# Altium project PCB_3U_DAC.PrjPCB (part 2 of 3)

## Sheet Output_channel.SchDoc: Output
size 420 x 297 mm; Author: G.K.; CompanyName: WUT; DrawnBy: G.K.; Organization: WUT ISE; Address1: Warsaw Univeristy of Technology; Address2: Nowowiejska 15/19; DocumentNumber: 4; Revision: -; SheetNumber: 4; SheetTotal: 7; EDA_Number: ARTIQ; Projet: Zotino; ModifiedBy: -; CreateDate: XX/XX/XXXX; CheckedDate: -; Title2: filter; DivGrp: ISE; Designer: G.K.; ModifiedDate: -; ProjectName: 32 CHANNEL 16bit DAC
Used 32 times, as channels U_Output_channel1, U_Output_channel2, U_Output_channel3, U_Output_channel4, U_Output_channel5, U_Output_channel6, U_Output_channel7, U_Output_channel8, U_Output_channel9, U_Output_channel10, U_Output_channel11, U_Output_channel12, U_Output_channel13, U_Output_channel14, U_Output_channel15, U_Output_channel16, U_Output_channel17, U_Output_channel18, U_Output_channel19, U_Output_channel20, U_Output_channel21, U_Output_channel22, U_Output_channel23, U_Output_channel24, U_Output_channel25, U_Output_channel26, U_Output_channel27, U_Output_channel28, U_Output_channel29, U_Output_channel30, U_Output_channel31, U_Output_channel32. Parts and nets are listed once, with the designators drawn on the sheet.
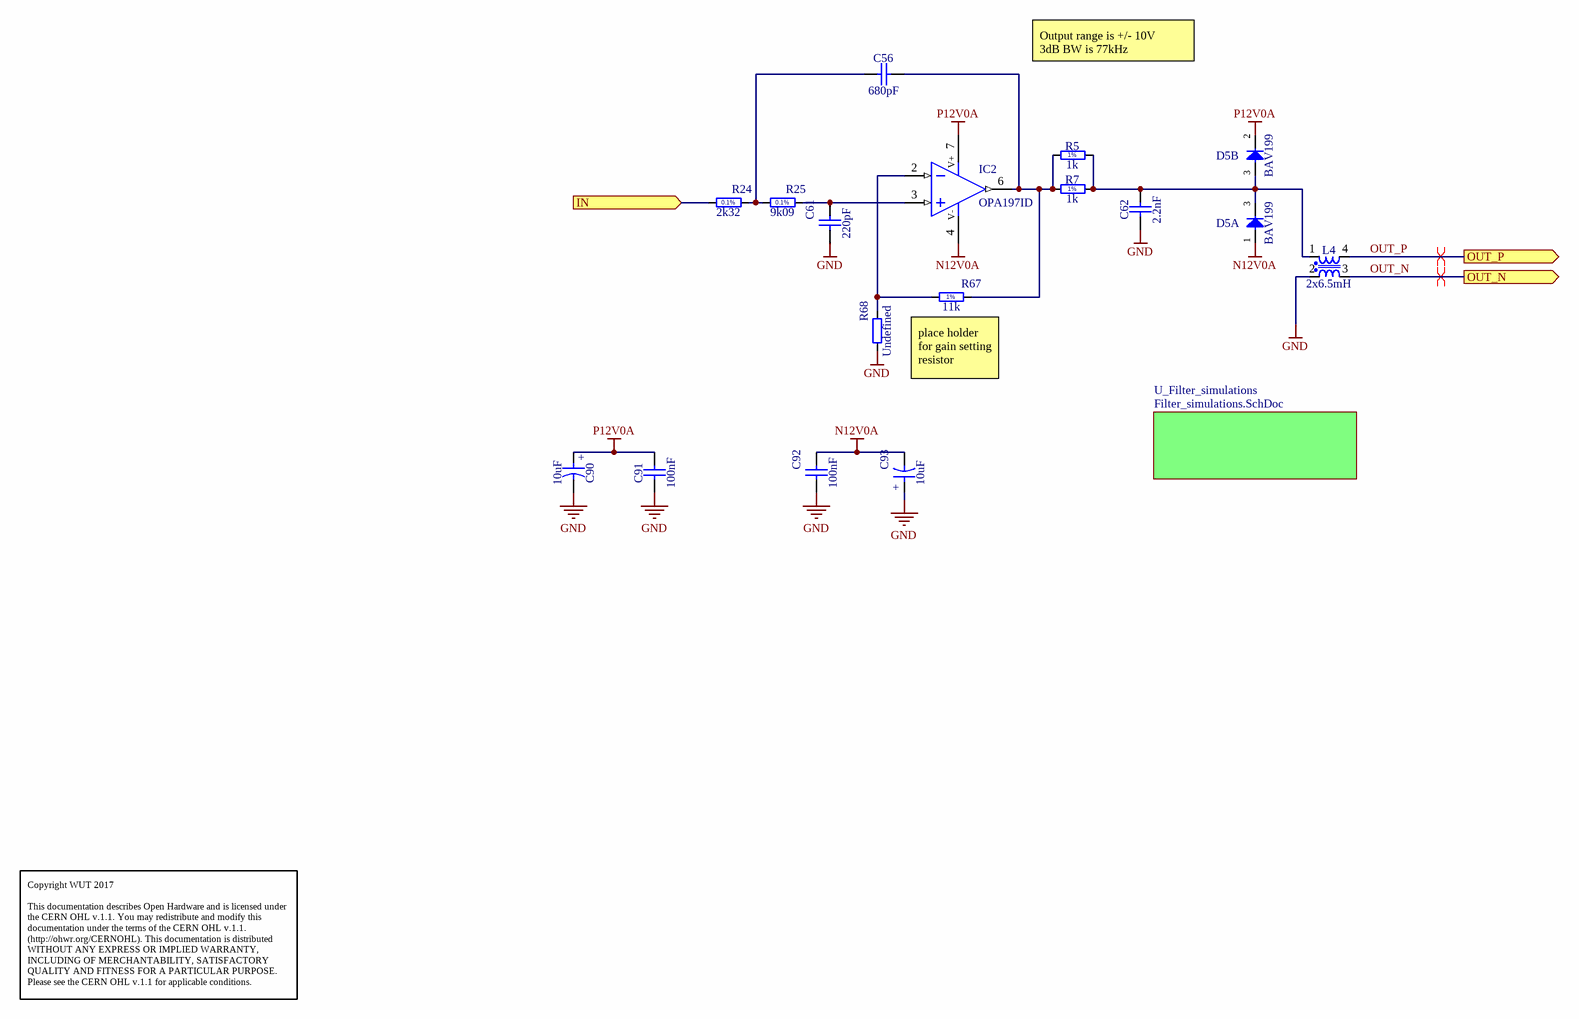
[diagram p2: Output_channel.SchDoc]

### Parts
C56  680pF  [CAPC2012X135N]
C61  220pF  [CAPC1608X87N]
C62  2.2nF  [CAPC3216X140N]
C90  10uF  [CAPMP3216X180N]
C91  100nF  [CAPC1005X55N]
C92  100nF  [CAPC1005X55N]
C93  10uF  [CAPMP3216X180N]
D5  BAV199  [SOT95P240X110-3N]  (parts A,B of 2)
IC2  OPA197ID  [SOIC127P600X175-8N]
L4  2x6.5mH  [IND_WURTH_WE-SL2]
R5  1k  [RESC1608X55N]
R7  1k  [RESC1608X55N]
R24  2k32  [RESC1608X55N]
R25  9k09  [RESC1608X55N]
R67  11k  [RESC1608X55N]
R68  Undefined  [RESC1608X55N]

### Sub-sheets
U_Filter_simulations = Filter_simulations.SchDoc: no entries

### Ports
IN (in), OUT_N (out), OUT_P (out)

### Nets
GND: C61.1 C62.1 C90.2 C91.1 C92.1 C93.1 L4.2 R68.1
N12V0A: C92.2 C93.2 D5.1(A) IC2.4(V-)
P12V0A: C90.1 C91.2 D5.2(C) IC2.7(V+)
IN: R24.1 ; port IN
OUT_N: L4.3 ; port OUT_N
OUT_P: L4.4 ; port OUT_P
NetC56_1: C56.1 R24.2 R25.1
NetC56_2: C56.2 IC2.6(OUT) R5.1 R7.1 R67.2
NetC61_2: C61.2 IC2.3(IN+) R25.2
NetC62_2: C62.2 D5.3(COMAC) L4.1 R5.2 R7.2
NetIC2_2: IC2.2(IN-) R67.1 R68.2

### Channels
U_Output_channel1: designators end in _1; ports IN=VOUT1 OUT_N=DAC_OUT_N1 OUT_P=DAC_OUT_P1
U_Output_channel2: designators end in _2; ports IN=VOUT2 OUT_N=DAC_OUT_N2 OUT_P=DAC_OUT_P2
U_Output_channel3: designators end in _3; ports IN=VOUT3 OUT_N=DAC_OUT_N3 OUT_P=DAC_OUT_P3
U_Output_channel4: designators end in _4; ports IN=VOUT4 OUT_N=DAC_OUT_N4 OUT_P=DAC_OUT_P4
U_Output_channel5: designators end in _5; ports IN=VOUT5 OUT_N=DAC_OUT_N5 OUT_P=DAC_OUT_P5
U_Output_channel6: designators end in _6; ports IN=VOUT6 OUT_N=DAC_OUT_N6 OUT_P=DAC_OUT_P6
U_Output_channel7: designators end in _7; ports IN=VOUT7 OUT_N=DAC_OUT_N7 OUT_P=DAC_OUT_P7
U_Output_channel8: designators end in _8; ports IN=VOUT8 OUT_N=DAC_OUT_N8 OUT_P=DAC_OUT_P8
U_Output_channel9: designators end in _9; ports IN=VOUT9 OUT_N=DAC_OUT_N9 OUT_P=DAC_OUT_P9
U_Output_channel10: designators end in _10; ports IN=VOUT10 OUT_N=DAC_OUT_N10 OUT_P=DAC_OUT_P10
U_Output_channel11: designators end in _11; ports IN=VOUT11 OUT_N=DAC_OUT_N11 OUT_P=DAC_OUT_P11
U_Output_channel12: designators end in _12; ports IN=VOUT12 OUT_N=DAC_OUT_N12 OUT_P=DAC_OUT_P12
U_Output_channel13: designators end in _13; ports IN=VOUT13 OUT_N=DAC_OUT_N13 OUT_P=DAC_OUT_P13
U_Output_channel14: designators end in _14; ports IN=VOUT14 OUT_N=DAC_OUT_N14 OUT_P=DAC_OUT_P14
U_Output_channel15: designators end in _15; ports IN=VOUT15 OUT_N=DAC_OUT_N15 OUT_P=DAC_OUT_P15
U_Output_channel16: designators end in _16; ports IN=VOUT16 OUT_N=DAC_OUT_N16 OUT_P=DAC_OUT_P16
U_Output_channel17: designators end in _17; ports IN=VOUT17 OUT_N=DAC_OUT_N17 OUT_P=DAC_OUT_P17
U_Output_channel18: designators end in _18; ports IN=VOUT18 OUT_N=DAC_OUT_N18 OUT_P=DAC_OUT_P18
U_Output_channel19: designators end in _19; ports IN=VOUT19 OUT_N=DAC_OUT_N19 OUT_P=DAC_OUT_P19
U_Output_channel20: designators end in _20; ports IN=VOUT20 OUT_N=DAC_OUT_N20 OUT_P=DAC_OUT_P20
U_Output_channel21: designators end in _21; ports IN=VOUT21 OUT_N=DAC_OUT_N21 OUT_P=DAC_OUT_P21
U_Output_channel22: designators end in _22; ports IN=VOUT22 OUT_N=DAC_OUT_N22 OUT_P=DAC_OUT_P22
U_Output_channel23: designators end in _23; ports IN=VOUT23 OUT_N=DAC_OUT_N23 OUT_P=DAC_OUT_P23
U_Output_channel24: designators end in _24; ports IN=VOUT24 OUT_N=DAC_OUT_N24 OUT_P=DAC_OUT_P24
U_Output_channel25: designators end in _25; ports IN=VOUT25 OUT_N=DAC_OUT_N25 OUT_P=DAC_OUT_P25
U_Output_channel26: designators end in _26; ports IN=VOUT26 OUT_N=DAC_OUT_N26 OUT_P=DAC_OUT_P26
U_Output_channel27: designators end in _27; ports IN=VOUT27 OUT_N=DAC_OUT_N27 OUT_P=DAC_OUT_P27
U_Output_channel28: designators end in _28; ports IN=VOUT28 OUT_N=DAC_OUT_N28 OUT_P=DAC_OUT_P28
U_Output_channel29: designators end in _29; ports IN=VOUT29 OUT_N=DAC_OUT_N29 OUT_P=DAC_OUT_P29
U_Output_channel30: designators end in _30; ports IN=VOUT30 OUT_N=DAC_OUT_N30 OUT_P=DAC_OUT_P30
U_Output_channel31: designators end in _31; ports IN=VOUT31 OUT_N=DAC_OUT_N31 OUT_P=DAC_OUT_P31
U_Output_channel32: designators end in _32; ports IN=VOUT32 OUT_N=DAC_OUT_N32 OUT_P=DAC_OUT_P32

### Layout directives
differential pair: DAC_OUT_N1, DAC_OUT_P1

### Notes on the sheet
- Output range is +/- 10V
  3dB BW is 77kHz
- place holder for gain setting resistor
- Copyright WUT 2017
  This documentation describes Open Hardware and is licensed under the CERN OHL v.1.1. You may redistribute and modify this documentation under the terms of the CERN OHL v.1.1. (http://ohwr.org/CERNOHL). This documentation is distributed WITHOUT ANY EXPRESS OR IMPLIED WARRANTY, INCLUDING OF MERCHANTABILITY, SATISFACTORY QUALITY AND FITNESS FOR A PARTICULAR PURPOSE. Please see the CERN OHL v.1.1 for applicable conditions.
- Project/Equipment
- Document
- Designer
- Drawn by
- Check.by
- File
- Last Mod.
- Print Date
- Sheet
- Size
- A3
- of
- Rev
- (in symbol CTE3216-18_10UF_16V_20%_AVX_TCJ) +
- (in symbol R0603_1K_1%_0.1W_100PPM) 1%
- (in symbol R0603_2K32_0.1%_0.063W_10PPM) 0.1%
- (in symbol R0603_9K09_0.1%_0.063W_10PPM) 0.1%
- (in symbol R0603_11K_1%_0.1W_100PPM) 1%

### Library data of the parts
C56 = CC0805_680PF_50V_5%_NP0: Non-polarised capacitor; Part Description: SMD Multilayer Chip Ceramic Capacitor; Manufacturer: GENERIC; Manufacturer1 Part Number: 223886115681; Voltage: 50V; TC: C0G/NP0; Tolerance: ±5%; Part Number: CC0805_680PF_50V_5%_NP0; Component Kind: Standard; Component Type: Standard; Pin Count: 2; Value: 680pF; Status: Preferred; Manufacturer Part Number: CC0805_680PF_50V_5%_NP0; Case: 0805; Mounted: Yes; Socket: No; SMD: Yes; Sense: No; Manufacturer1 Example: PHYCOMP; Manufacturer1 ComponentHeight: 1.35mm; HelpURL: \\cern.ch\dfs\Applications\Altium\Datasheets\CC0805_NP0_PHYCOMP.pdf; Author: CERN DEM JLC; CreateDate: 03.12.2007; LatestRevisionDate: 03.12.2007
C61 = CC0603_220PF_50V_5%_NP0: Non-polarised capacitor; Part Description: SMD Multilayer Chip Ceramic Capacitor; Manufacturer: GENERIC; Manufacturer1 Part Number: 223886715221; Voltage: 50V; TC: C0G/NP0; Tolerance: ±5%; Part Number: CC0603_220PF_50V_5%_NP0; Component Kind: Standard; Component Type: Standard; Pin Count: 2; Value: 220pF; Status: Preferred; Manufacturer Part Number: CC0603_220PF_50V_5%_NP0; Case: 0603; Mounted: Yes; Socket: No; SMD: Yes; Sense: No; Manufacturer1 Example: PHYCOMP; Manufacturer1 ComponentHeight: 0.87mm; HelpURL: \\cern.ch\dfs\Applications\Altium\Datasheets\CC0603_NP0_PHYCOMP.pdf; Author: CERN DEM JLC; CreateDate: 03.12.2007; LatestRevisionDate: 03.12.2007
C62 = CC1206_2.2NF_50V_5%_NP0: Non-polarised capacitor; Part Description: SMD Multilayer Chip Ceramic Capacitor; Manufacturer: GENERIC; Manufacturer1 Part Number: 2238 863 15222; Voltage: 50V; TC: C0G/NP0; Tolerance: ±5%; Part Number: CC1206_2.2NF_50V_5%_NP0; Component Kind: Standard; Component Type: Standard; Pin Count: 2; Value: 2.2nF; Status: Preferred; Manufacturer Part Number: CC1206_2.2NF_50V_5%_NP0; Case: 1206; Mounted: Yes; Socket: No; SMD: Yes; Sense: No; Manufacturer1 Example: PHYCOMP; Manufacturer1 ComponentHeight: 1.25mm; HelpURL: \\cern.ch\dfs\Applications\Altium\Datasheets\CC1206_NP0_PHYCOMP.pdf; Author: CERN DEM JLC; CreateDate: 03.12.2007; LatestRevisionDate: 03.12.2007
C90 C93 = CTE3216-18_10UF_16V_20%_AVX_TCJ: Polarised capacitor; Part Description: ESR 0R200 Tantalum Solid Electrolytic Chip Capacitor with Conductive Polymer Electrode; Manufacturer: AVX; Manufacturer Part Number: TCJA106M016R0200; Voltage: 16V; Tolerance: ±20%; Part Number: CTE3216-18_10UF_16V_20%_AVX_TCJ; Component Kind: Standard; Component Type: Standard; Pin Count: 2; Value: 10uF; Status: Preferred; Case: A; Mounted: Yes; Socket: No; SMD: Yes; Sense: No; ComponentHeight: 1.8mm; HelpURL: \\cern.ch\dfs\Applications\Altium\Datasheets\CTE_AVX_TCJ.pdf; Author: CERN DEM JLC; CreateDate: 29.03.2012; LatestRevisionDate: 29.03.2012
C91 C92 = CC0402_100NF_16V_10%_X7R: Non-polarised capacitor; Part Description: SMD Multilayer Chip Ceramic Capacitor; Manufacturer: GENERIC; Manufacturer1 Part Number: GRM155R71C104KA88D; Voltage: 16V; TC: X7R; Tolerance: ±10%; Part Number: CC0402_100NF_16V_10%_X7R; Component Kind: Standard; Component Type: Standard; Pin Count: 2; Value: 100nF; Status: Not Recommended; Manufacturer Part Number: CC0402_100NF_16V_10%_X7R; Case: 0402; Mounted: Yes; Socket: No; SMD: Yes; Sense: No; Manufacturer1 Example: MURATA; Manufacturer1 ComponentHeight: 0.55mm; HelpURL: \\cern.ch\dfs\Applications\Altium\Datasheets\CC0402_X7R_MURATA_GRM.pdf; Author: CERN DEM JLC; CreateDate: 2013-12-05; LatestRevisionDate: 2007-12-03
D5 = BAV199: Serial Diode; Part Description: Low-Leakage Double Diode; Manufacturer: NXP SEMICONDUCTORS; Voltage: 75V; Power: 250mW; PressFit: No; Bonding: No; Part Number: BAV199; Component Kind: Standard; Component Type: Standard; Device: BAV199; PackageDescription: SOT23 3-Leads, Pitch 0.95mm - Body 1.4x3mm, IPC Medium Density; Manufacturer Part Number: BAV199; Pin Count: 3; Case: SOT23-3; Mounted: Yes; Socket: No; SMD: Yes; Sense: No; ComponentHeight: 1.1mm; HelpURL: \\cern.ch\dfs\Applications\Altium\Datasheets\BAV199.pdf; Author: CERN DEM JMW; CreateDate: 2008-11-21; LatestRevisionDate: 2008-11-21
IC2 = OA_OPA197: 36-V, Precision, Rail-to-Rail Input/Output, Low Offset Voltage, Operational Amplifiers; Manufacturer: TEXAS INSTRUMENTS; PressFit: No; Bonding: No; Part Number: OPA197ID; Component Kind: Standard; Component Type: Standard; Device: OPA197ID; PackageDescription: SOIC 8, Pitch 1.27mm - Body 4x5mm, IPC Medium Density; Part Description: 36-V, Precision, Rail-to-Rail Input/Output, Low Offset Voltage, Operational Amplifiers; Manufacturer Part Number: OPA197ID; Pin Count: 5; Case: SOIC8; Mounted: Yes; Socket: No; SMD: Yes; Sense: No; ComponentHeight: 1.75mm; Author: GK; HelpURL: \\cern.ch\dfs\Applications\Altium\Datasheets\OPA192ID.pdf; CreateDate: 22.07.2015; LatestRevisionDate: 22.07.2015
L4 = IND_6.5MH_50%_WURTH_WE-SL2-744229: Inductor Common Mode; Part Description: Common Mode SMD Line Filter (WE-SL2 Serie); Manufacturer: WURTH ELEKTRONIK; Manufacturer Part Number: 744229; Power: 400mA; Resistance: 0.95R; Tolerance: ±50%; Part Number: IND_6.5MH_50%_WURTH_WE-SL2-744229; Component Kind: Standard; Component Type: Standard; Pin Count: 4; Value: 2x6.5mH; Status: None; Mounted: Yes; Socket: No; SMD: Yes; Sense: No; ComponentHeight: 5.3mm; HelpURL: \\cern.ch\dfs\Applications\Altium\Datasheets\IND_WURTH_WE-SL2_744229.pdf; Author: CERN DEM JLC; CreateDate: 01.10.2012; LatestRevisionDate: 15.10.2012
R5 R7 = R0603_1K_1%_0.1W_100PPM: Resistor - 1%; Part Description: General Purpose Thick Film Chip Resistor; Manufacturer: GENERIC; Manufacturer1 Part Number: NRC06F1001TRF; Power: 0.1W; TC: ±100ppm/°C; PressFit: No; Part Number: R0603_1K_1%_0.1W_100PPM; Component Kind: Standard; Component Type: Standard; Pin Count: 2; Value: 1k; Status: Preferred; Tolerance: ±1%; Manufacturer Part Number: R0603_1K_1%_0.1W_100PPM; Case: 0603; Mounted: Yes; Sense: No; Socket: No; SMD: Yes; Manufacturer1 Example: NIC COMPONENT; Manufacturer1 ComponentHeight: 0.55mm; HelpURL: \\cern.ch\dfs\Applications\Altium\Datasheets\R0603_NIC_NRC.pdf; Author: CERN DEM JLC; CreateDate: 03.12.2007; LatestRevisionDate: 13.03.2008
R24 = R0603_2K32_0.1%_0.063W_10PPM: Resistor - 0.1%; Part Description: Thin Film Chip Resistor; Manufacturer: GENERIC; Manufacturer1 Part Number: RN73C1J2K32BTDF; Power: 0.063W; TC: ±10ppm; Part Number: R0603_2K32_0.1%_0.063W_10PPM; Component Kind: Standard; Component Type: Standard; Pin Count: 2; Value: 2k32; Status: Not recommended; Tolerance: ±0.1%; Manufacturer Part Number: R0603_2K32_0.1%_0.063W_10PPM; Case: 0603; Mounted: Yes; Sense: No; Socket: No; SMD: Yes; Manufacturer1 Example: TYCO HOLSWORTHY; Manufacturer1 ComponentHeight: 0.5mm; HelpURL: \\cern.ch\dfs\Applications\Altium\Datasheets\R0603_Tyco_RN73.pdf; Author: CERN DEM JLC; CreateDate: 03.12.2007; LatestRevisionDate: 13.03.2008
R25 = R0603_9K09_0.1%_0.063W_10PPM: Resistor - 0.1%; Part Description: Thin Film Chip Resistor; Manufacturer: GENERIC; Manufacturer1 Part Number: RN73C1J9K09BTDF; Power: 0.063W; TC: ±10ppm; Part Number: R0603_9K09_0.1%_0.063W_10PPM; Component Kind: Standard; Component Type: Standard; Pin Count: 2; Value: 9k09; Status: Not recommended; Tolerance: ±0.1%; Manufacturer Part Number: R0603_9K09_0.1%_0.063W_10PPM; Case: 0603; Mounted: Yes; Sense: No; Socket: No; SMD: Yes; Manufacturer1 Example: TYCO HOLSWORTHY; Manufacturer1 ComponentHeight: 0.5mm; HelpURL: \\cern.ch\dfs\Applications\Altium\Datasheets\R0603_Tyco_RN73.pdf; Author: CERN DEM JLC; CreateDate: 03.12.2007; LatestRevisionDate: 13.03.2008
R67 = R0603_11K_1%_0.1W_100PPM: Resistor - 1%; Part Description: General Purpose Thick Film Chip Resistor; Manufacturer: GENERIC; Manufacturer1 Part Number: NRC06F1102TRF; Power: 0.1W; TC: ±100ppm/°C; Part Number: R0603_11K_1%_0.1W_100PPM; Component Kind: Standard; Component Type: Standard; Pin Count: 2; Value: 11k; Status: Preferred; Tolerance: ±1%; Manufacturer Part Number: R0603_11K_1%_0.1W_100PPM; Case: 0603; Mounted: Yes; Sense: No; Socket: No; SMD: Yes; Manufacturer1 Example: NIC COMPONENT; Manufacturer1 ComponentHeight: 0.55mm; HelpURL: \\cern.ch\dfs\Applications\Altium\Datasheets\R0603_NIC_NRC.pdf; Author: CERN DEM JLC; CreateDate: 03.12.2007; LatestRevisionDate: 13.03.2008
R68 = R0603_NO-VALUE: Resistor; Part Description: Reserved Footprint For a 0603 (1608) Chip Resistor; Mounted: No; Part Number: R0603_NO-VALUE; Component Kind: Standard; Component Type: Standard; Pin Count: 2; Value: Undefined; Status: None; Manufacturer: Undefined; Manufacturer Part Number: R0603_NO-VALUE; Case: 0603; Sense: No; Socket: No; SMD: Yes; Manufacturer1 Example: Undefined; Manufacturer1 Part Number: Undefined; Manufacturer1 ComponentHeight: Undefined; HelpURL: Undefined; Author: CERN DEM JLC; CreateDate: 03.12.2007; LatestRevisionDate: 13.03.2008

## Sheet Filter_simulations.SchDoc: Simulations
size 420 x 297 mm; Author: G.K.; CompanyName: WUT; DrawnBy: G.K.; Organization: WUT ISE; Address1: Warsaw Univeristy of Technology; Address2: Nowowiejska 15/19; Revision: -; SheetNumber: -; SheetTotal: -; EDA_Number: ARTIQ; Projet: Zotino; ModifiedBy: -; CreateDate: XX/XX/XXXX; CheckedDate: -; DivGrp: ISE; Designer: G.K.; ModifiedDate: -; ProjectName: 32 CHANNEL 16bit DAC
Used 32 times, as channels U_Output_channel1/U_Filter_simulations, U_Output_channel2/U_Filter_simulations, U_Output_channel3/U_Filter_simulations, U_Output_channel4/U_Filter_simulations, U_Output_channel5/U_Filter_simulations, U_Output_channel6/U_Filter_simulations, U_Output_channel7/U_Filter_simulations, U_Output_channel8/U_Filter_simulations, U_Output_channel9/U_Filter_simulations, U_Output_channel10/U_Filter_simulations, U_Output_channel11/U_Filter_simulations, U_Output_channel12/U_Filter_simulations, U_Output_channel13/U_Filter_simulations, U_Output_channel14/U_Filter_simulations, U_Output_channel15/U_Filter_simulations, U_Output_channel16/U_Filter_simulations, U_Output_channel17/U_Filter_simulations, U_Output_channel18/U_Filter_simulations, U_Output_channel19/U_Filter_simulations, U_Output_channel20/U_Filter_simulations, U_Output_channel21/U_Filter_simulations, U_Output_channel22/U_Filter_simulations, U_Output_channel23/U_Filter_simulations, U_Output_channel24/U_Filter_simulations, U_Output_channel25/U_Filter_simulations, U_Output_channel26/U_Filter_simulations, U_Output_channel27/U_Filter_simulations, U_Output_channel28/U_Filter_simulations, U_Output_channel29/U_Filter_simulations, U_Output_channel30/U_Filter_simulations, U_Output_channel31/U_Filter_simulations, U_Output_channel32/U_Filter_simulations. Parts and nets are listed once, with the designators drawn on the sheet.
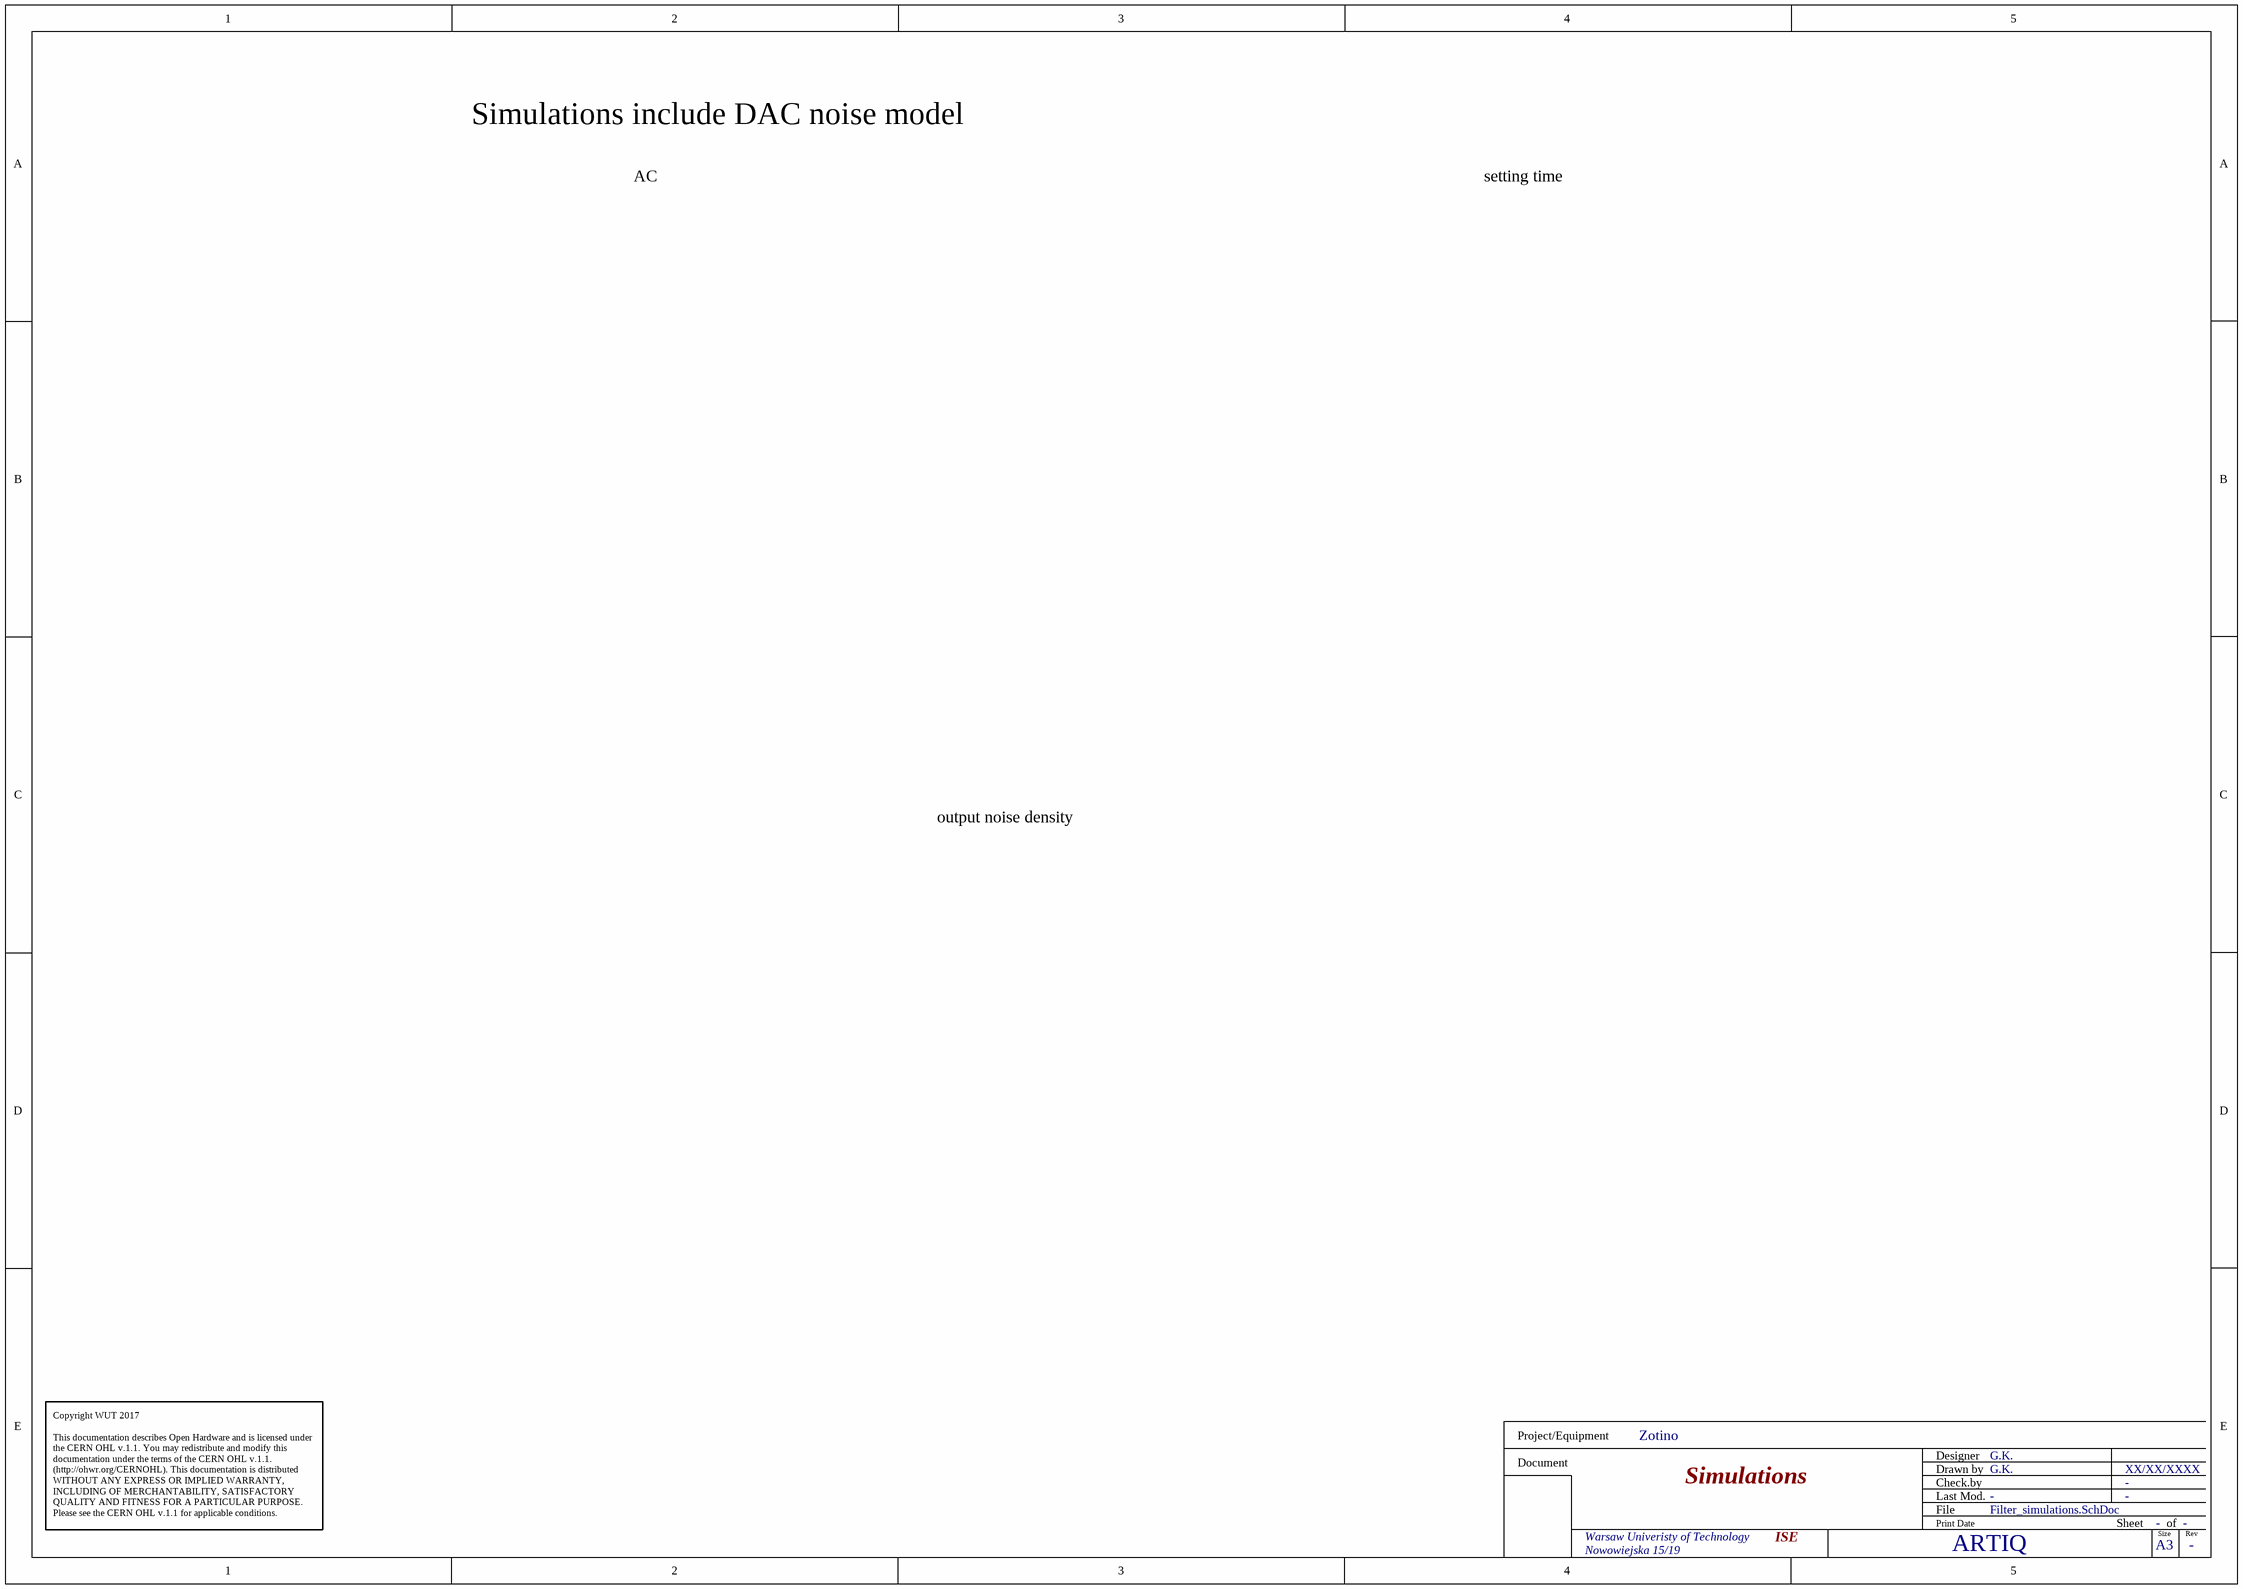
[diagram p3: Filter_simulations.SchDoc]

### Channels
U_Output_channel1/U_Filter_simulations: no parts or ports
U_Output_channel2/U_Filter_simulations: no parts or ports
U_Output_channel3/U_Filter_simulations: no parts or ports
U_Output_channel4/U_Filter_simulations: no parts or ports
U_Output_channel5/U_Filter_simulations: no parts or ports
U_Output_channel6/U_Filter_simulations: no parts or ports
U_Output_channel7/U_Filter_simulations: no parts or ports
U_Output_channel8/U_Filter_simulations: no parts or ports
U_Output_channel9/U_Filter_simulations: no parts or ports
U_Output_channel10/U_Filter_simulations: no parts or ports
U_Output_channel11/U_Filter_simulations: no parts or ports
U_Output_channel12/U_Filter_simulations: no parts or ports
U_Output_channel13/U_Filter_simulations: no parts or ports
U_Output_channel14/U_Filter_simulations: no parts or ports
U_Output_channel15/U_Filter_simulations: no parts or ports
U_Output_channel16/U_Filter_simulations: no parts or ports
U_Output_channel17/U_Filter_simulations: no parts or ports
U_Output_channel18/U_Filter_simulations: no parts or ports
U_Output_channel19/U_Filter_simulations: no parts or ports
U_Output_channel20/U_Filter_simulations: no parts or ports
U_Output_channel21/U_Filter_simulations: no parts or ports
U_Output_channel22/U_Filter_simulations: no parts or ports
U_Output_channel23/U_Filter_simulations: no parts or ports
U_Output_channel24/U_Filter_simulations: no parts or ports
U_Output_channel25/U_Filter_simulations: no parts or ports
U_Output_channel26/U_Filter_simulations: no parts or ports
U_Output_channel27/U_Filter_simulations: no parts or ports
U_Output_channel28/U_Filter_simulations: no parts or ports
U_Output_channel29/U_Filter_simulations: no parts or ports
U_Output_channel30/U_Filter_simulations: no parts or ports
U_Output_channel31/U_Filter_simulations: no parts or ports
U_Output_channel32/U_Filter_simulations: no parts or ports

### Notes on the sheet
- Simulations include DAC noise model
- AC
- setting time
- output noise density
- Copyright WUT 2017
  This documentation describes Open Hardware and is licensed under the CERN OHL v.1.1. You may redistribute and modify this documentation under the terms of the CERN OHL v.1.1. (http://ohwr.org/CERNOHL). This documentation is distributed WITHOUT ANY EXPRESS OR IMPLIED WARRANTY, INCLUDING OF MERCHANTABILITY, SATISFACTORY QUALITY AND FITNESS FOR A PARTICULAR PURPOSE. Please see the CERN OHL v.1.1 for applicable conditions.
- Project/Equipment
- Document
- Designer
- Drawn by
- Check.by
- File
- Last Mod.
- Print Date
- Sheet
- Size
- A3
- of
- Rev

## Sheet DAC_32CH.SchDoc: DAC
size 420 x 297 mm; Author: G.K.; CompanyName: WUT; DrawnBy: G.K.; Organization: WUT ISE; Address1: Warsaw Univeristy of Technology; Address2: Nowowiejska 15/19; DocumentNumber: 2; Revision: -; SheetNumber: 2; SheetTotal: 7; EDA_Number: ARTIQ; Projet: Zotino; ModifiedBy: -; CreateDate: XX/XX/XXXX; CheckedDate: -; Title2: & reference; DivGrp: ISE; Designer: G.K.; ModifiedDate: -; ProjectName: 32 CHANNEL 16bit DAC
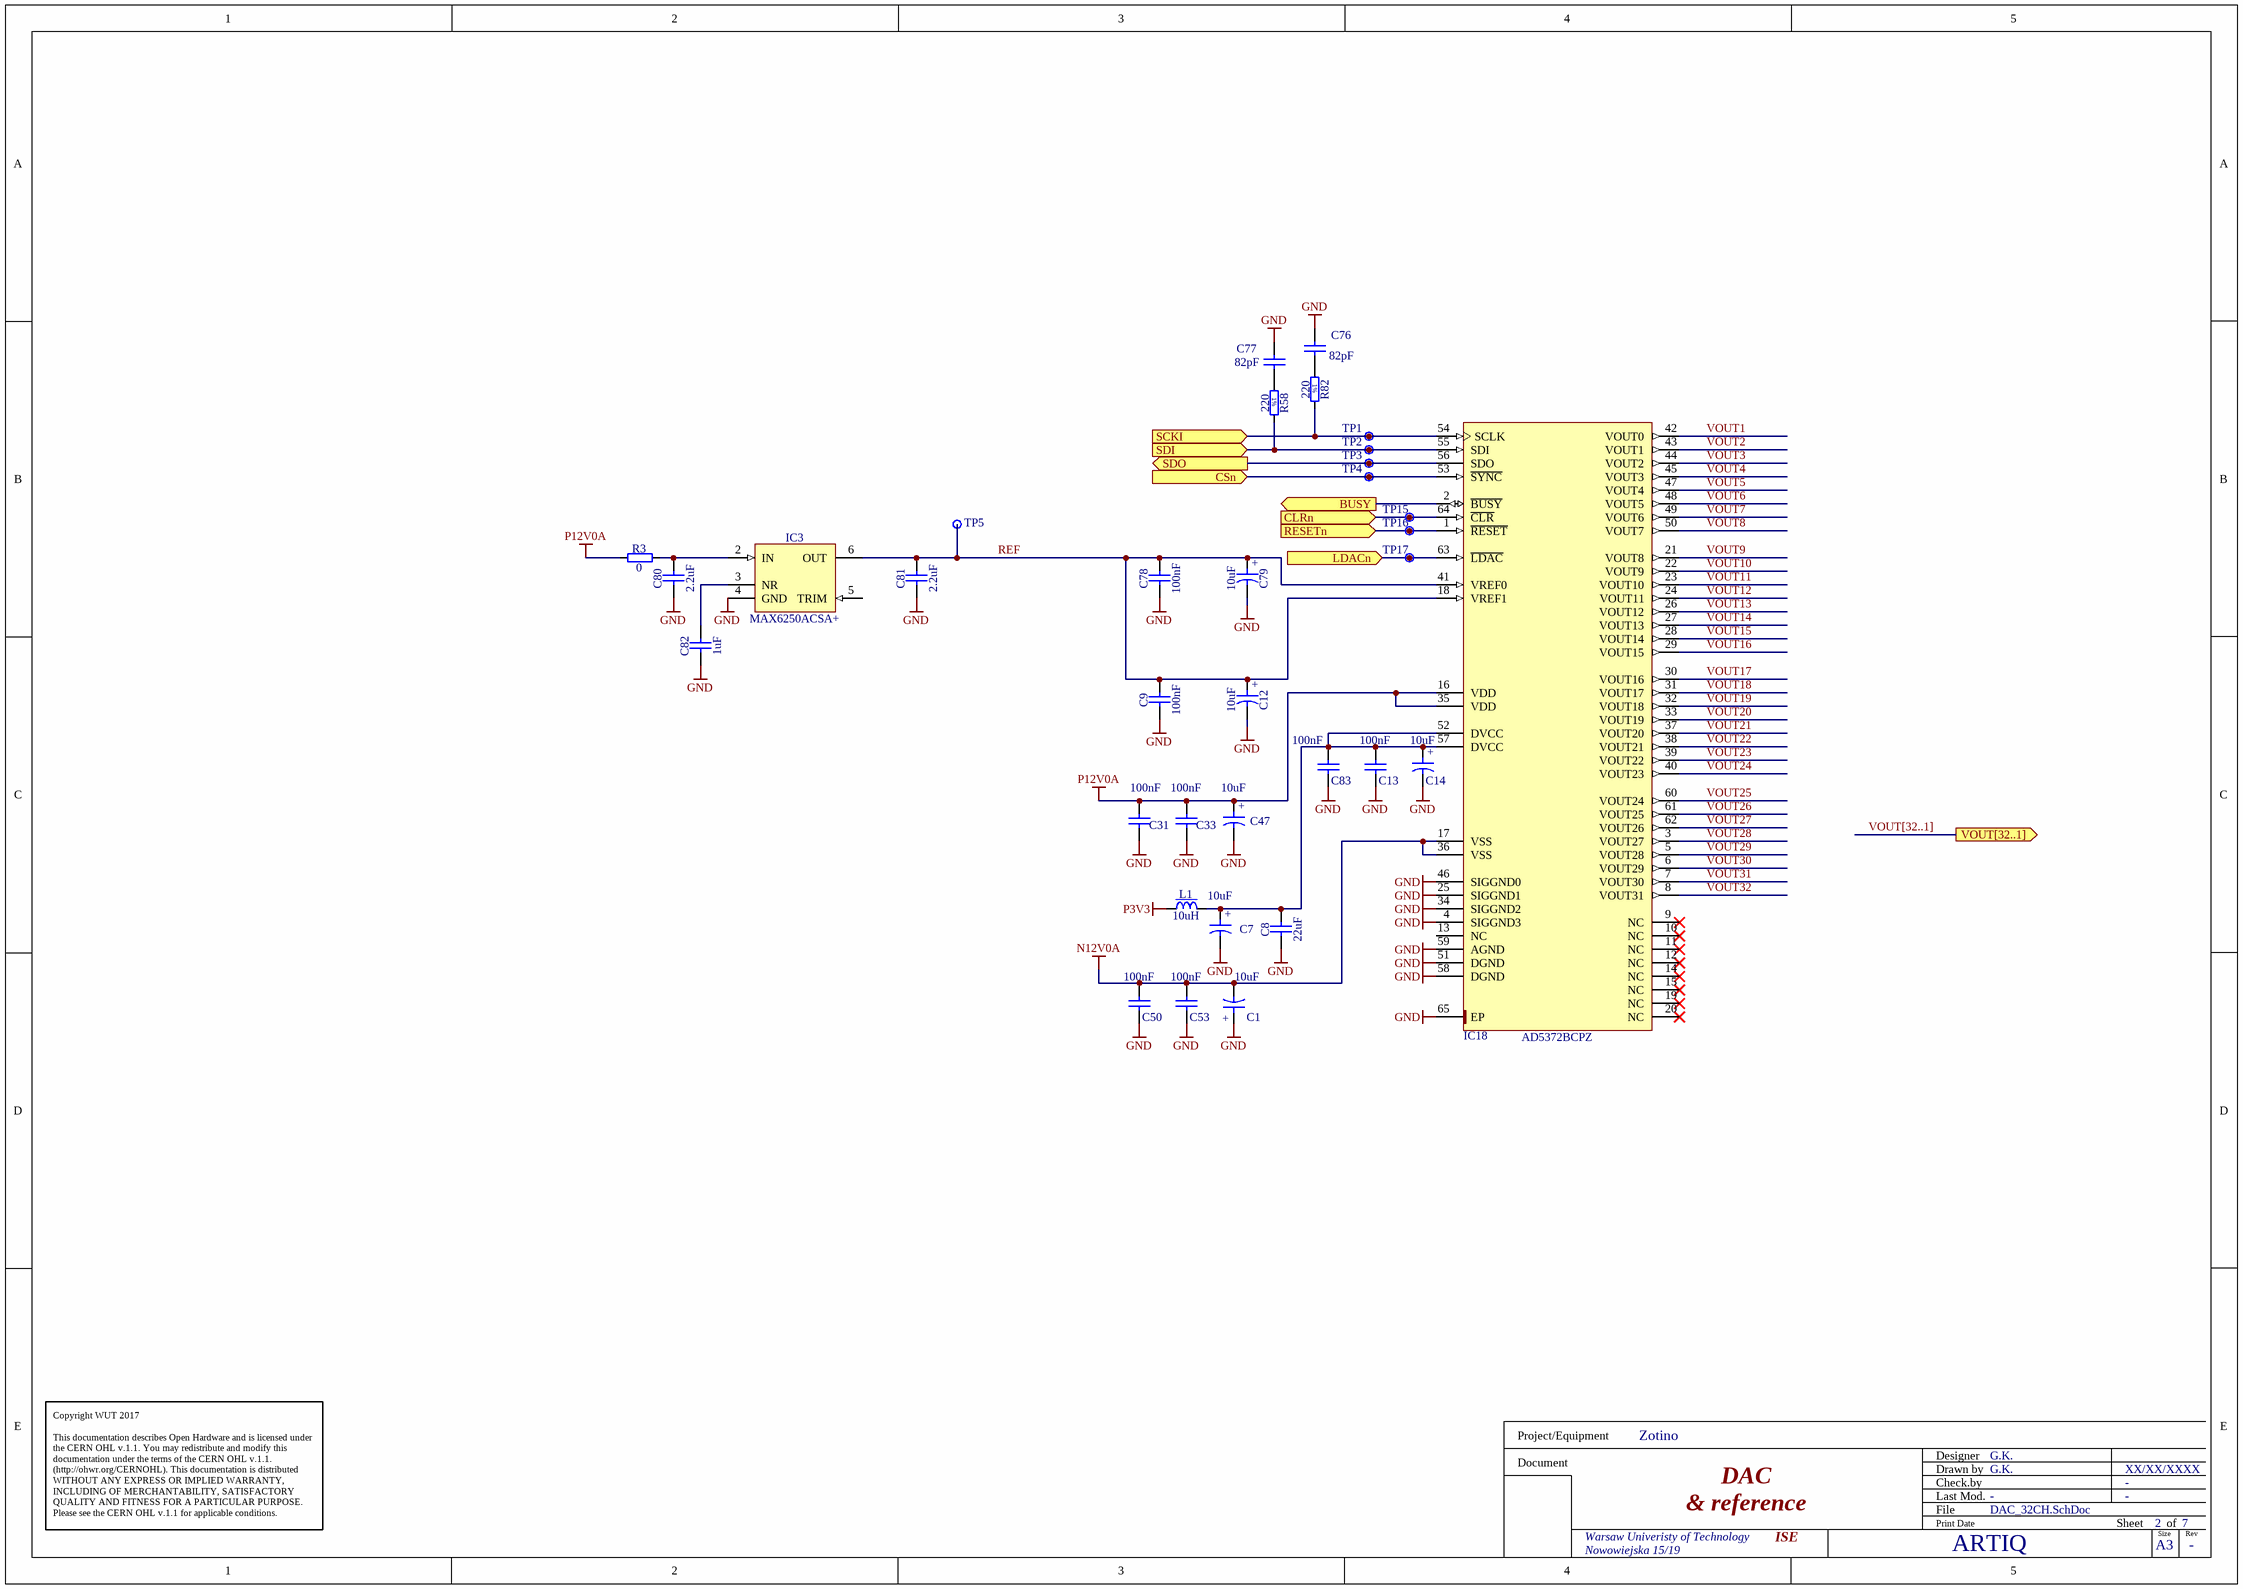
[diagram p4: DAC_32CH.SchDoc]

### Parts
C1  10uF  [CAPMP3216X180N]
C7  10uF  [CAPMP3216X180N]
C8  22uF  [CAPC2012X135N]
C9  100nF  [CAPC1005X55N]
C12  10uF  [CAPMP3216X180N]
C13  100nF  [CAPC1005X55N]
C14  10uF  [CAPMP3216X180N]
C31  100nF  [CAPC1005X55N]
C33  100nF  [CAPC1005X55N]
C47  10uF  [CAPMP3216X180N]
C50  100nF  [CAPC1005X55N]
C53  100nF  [CAPC1005X55N]
C76  82pF  [CAPC1608X87N]
C77  82pF  [CAPC1608X87N]
C78  100nF  [CAPC1005X55N]
C79  10uF  [CAPMP3216X180N]
C80  2.2uF  [CAPC1608X87N]
C81  2.2uF  [CAPC1608X87N]
C82  1uF  [CAPC1608X87N]
C83  100nF  [CAPC1005X55N]
IC3  MAX6250ACSA+  [SOIC127P600X175-8N]
IC18  AD5372BCPZ  [QFN50P900X900X100-65N-S725]
L1  10uH  [IND_MURATA-PS_8400]
R3  0  [RESC1005X40N]
R58  220  [RESC1608X55N]
R82  220  [RESC1608X55N]
TP1  Test Point  [TPS127]  (value not drawn)
TP2  Test Point  [TPS127]  (value not drawn)
TP3  Test Point  [TPS127]  (value not drawn)
TP4  Test Point  [TPS127]  (value not drawn)
TP5  Test Point  [TPS127]  (value not drawn)
TP15  Test Point  [TPS127]  (value not drawn)
TP16  Test Point  [TPS127]  (value not drawn)
TP17  Test Point  [TPS127]  (value not drawn)

### Ports
BUSY (out), CLRn (in), CSn (in), LDACn (in), RESETn (in), SCKI (in), SDI (in), SDO (out), VOUT[32..1] (out)

### Nets
GND: C1.1 C7.2 C8.1 C9.1 C12.2 C13.1 C14.2 C31.1 C33.1 C47.2 C50.1 C53.1 C76.1 C77.1 C78.1 C79.2 C80.1 C81.1 C82.1 C83.1 IC3.4(GND) IC18.4(SIGGND3) IC18.25(SIGGND1) IC18.34(SIGGND2) IC18.46(SIGGND0) IC18.51(DGND) IC18.58(DGND) IC18.59(AGND) IC18.65(EP)
N12V0A: C1.2 C50.2 C53.2 IC18.17(VSS) IC18.36(VSS)
P3V3: L1.1
P12V0A: C31.2 C33.2 C47.1 IC18.16(VDD) IC18.35(VDD) R3.1
REF: C9.2 C12.1 C78.2 C79.1 C81.2 IC3.6(OUT) IC18.18(VREF1) IC18.41(VREF0) TP5.1
SCKI: IC18.54(SCLK) R82.2 TP1.1 ; port SCKI
SDI: IC18.55(SDI) R58.2 TP2.1 ; port SDI
VOUT1: IC18.42(VOUT0)
VOUT2: IC18.43(VOUT1)
VOUT3: IC18.44(VOUT2)
VOUT4: IC18.45(VOUT3)
VOUT5: IC18.47(VOUT4)
VOUT6: IC18.48(VOUT5)
VOUT7: IC18.49(VOUT6)
VOUT8: IC18.50(VOUT7)
VOUT9: IC18.21(VOUT8)
VOUT10: IC18.22(VOUT9)
VOUT11: IC18.23(VOUT10)
VOUT12: IC18.24(VOUT11)
VOUT13: IC18.26(VOUT12)
VOUT14: IC18.27(VOUT13)
VOUT15: IC18.28(VOUT14)
VOUT16: IC18.29(VOUT15)
VOUT17: IC18.30(VOUT16)
VOUT18: IC18.31(VOUT17)
VOUT19: IC18.32(VOUT18)
VOUT20: IC18.33(VOUT19)
VOUT21: IC18.37(VOUT20)
VOUT22: IC18.38(VOUT21)
VOUT23: IC18.39(VOUT22)
VOUT24: IC18.40(VOUT23)
VOUT25: IC18.60(VOUT24)
VOUT26: IC18.61(VOUT25)
VOUT27: IC18.62(VOUT26)
VOUT28: IC18.3(VOUT27)
VOUT29: IC18.5(VOUT28)
VOUT30: IC18.6(VOUT29)
VOUT31: IC18.7(VOUT30)
VOUT32: IC18.8(VOUT31)
NetC7_1: C7.1 C8.2 C13.2 C14.1 C83.2 IC18.52(DVCC) IC18.57(DVCC) L1.2
NetC76_2: C76.2 R82.1
NetC77_2: C77.2 R58.1
NetC80_2: C80.2 IC3.2(IN) R3.2
NetC82_2: C82.2 IC3.3(NR)
NetIC18_1: IC18.1(~{RESET}) TP16.1 ; port RESETn
NetIC18_2: IC18.2(~{BUSY}) ; port BUSY
NetIC18_53: IC18.53(~{SYNC}) TP4.1 ; port CSn
NetIC18_56: IC18.56(SDO) TP3.1 ; port SDO
NetIC18_63: IC18.63(~{LDAC}) TP17.1 ; port LDACn
NetIC18_64: IC18.64(~{CLR}) TP15.1 ; port CLRn

Not connected (* = marked no-connect by the designer): IC3 5(TRIM); IC18 9(NC)* 10(NC)* 11(NC)* 12(NC)* 13(NC) 14(NC)* 15(NC)* 19(NC)* 20(NC)*

### Buses and harness runs
bus VOUT[32..1] = port VOUT[32..1]

### Notes on the sheet
- Copyright WUT 2017
  This documentation describes Open Hardware and is licensed under the CERN OHL v.1.1. You may redistribute and modify this documentation under the terms of the CERN OHL v.1.1. (http://ohwr.org/CERNOHL). This documentation is distributed WITHOUT ANY EXPRESS OR IMPLIED WARRANTY, INCLUDING OF MERCHANTABILITY, SATISFACTORY QUALITY AND FITNESS FOR A PARTICULAR PURPOSE. Please see the CERN OHL v.1.1 for applicable conditions.
- Project/Equipment
- Document
- Designer
- Drawn by
- Check.by
- File
- Last Mod.
- Print Date
- Sheet
- Size
- A3
- of
- Rev
- (in symbol CTE3216-18_10UF_16V_20%_AVX_TCJ) +
- (in symbol R0603_220R_1%_0.1W_100PPM) 1%

### Library data of the parts
C1 C7 C12 C14 C47 C79 = CTE3216-18_10UF_16V_20%_AVX_TCJ: as C90 on sheet Output_channel; Part Number: CTE3216-18_10UF_16V_20%_AVX_TCJ; Component Kind: Standard; Component Type: Standard; Pin Count: 2; Value: 10uF; Status: Preferred; Case: A; Mounted: Yes; Socket: No; SMD: Yes; Sense: No; ComponentHeight: 1.8mm; HelpURL: \\cern.ch\dfs\Applications\Altium\Datasheets\CTE_AVX_TCJ.pdf; Author: CERN DEM JLC; CreateDate: 29.03.2012; LatestRevisionDate: 29.03.2012
C8 = CC0805_22UF_16V_10%_X5R: Non-polarised capacitor; Part Description: SMD Multilayer Chip Ceramic Capacitor; Manufacturer: GENERIC; Manufacturer1 Part Number: C2012X5R1C226KT; Voltage: 16V; TC: X5R; Tolerance: ±10%; Part Number: CC0805_22UF_16V_10%_X5R; Component Kind: Standard; Component Type: Standard; Pin Count: 2; Value: 22uF; Status: Preferred; Manufacturer Part Number: CC0805_22UF_16V_10%_X5R; Case: 0805; Mounted: Yes; Socket: No; SMD: Yes; Sense: No; Manufacturer1 Example: TDK; Manufacturer1 ComponentHeight: 1.35mm; HelpURL: \\cern.ch\dfs\Applications\Altium\Datasheets\CC0805_X5R_TDK_C.pdf; Author: CERN DEM JLC; CreateDate: 25.10.2012; LatestRevisionDate: 25.10.2012
C9 C13 C31 C33 C50 C53 C78 C83 = CC0402_100NF_16V_10%_X7R: as C91 on sheet Output_channel; Part Number: CC0402_100NF_16V_10%_X7R; Component Kind: Standard; Component Type: Standard; Pin Count: 2; Value: 100nF; Status: Not Recommended; Manufacturer Part Number: CC0402_100NF_16V_10%_X7R; Case: 0402; Mounted: Yes; Socket: No; SMD: Yes; Sense: No; Manufacturer1 Example: MURATA; Manufacturer1 ComponentHeight: 0.55mm; HelpURL: \\cern.ch\dfs\Applications\Altium\Datasheets\CC0402_X7R_MURATA_GRM.pdf; Author: CERN DEM JLC
  C9 C78: CreateDate: 2013-12-05; LatestRevisionDate: 2007-12-03
  C13 C31 C33 C50 C53 C83: CreateDate: 05.12.2013; LatestRevisionDate: 03.12.2007
C76 C77 = CC0603_82PF_50V_5%_NP0: Non-polarised capacitor; Part Description: SMD Multilayer Chip Ceramic Capacitor; Manufacturer: GENERIC; Manufacturer1 Part Number: 223886715829; Voltage: 50V; TC: C0G/NP0; Tolerance: ±5%; Part Number: CC0603_82PF_50V_5%_NP0; Component Kind: Standard; Component Type: Standard; Pin Count: 2; Value: 82pF; Status: Preferred; Manufacturer Part Number: CC0603_82PF_50V_5%_NP0; Case: 0603; Mounted: Yes; Socket: No; SMD: Yes; Sense: No; Manufacturer1 Example: PHYCOMP; Manufacturer1 ComponentHeight: 0.87mm; HelpURL: \\cern.ch\dfs\Applications\Altium\Datasheets\CC0603_NP0_PHYCOMP.pdf; Author: CERN DEM JLC; CreateDate: 03.12.2007; LatestRevisionDate: 03.12.2007
C80 C81 = CC0603_2.2UF_16V_10%_X5R: Non-polarised capacitor; Part Description: SMD Multilayer Chip Ceramic Capacitor; Manufacturer: GENERIC; Manufacturer1 Part Number: CC0603KRX5R7BB225; Voltage: 16V; TC: X5R; Tolerance: ±10%; Part Number: CC0603_2.2UF_16V_10%_X5R; Component Kind: Standard; Component Type: Standard; Pin Count: 2; Value: 2.2uF; Status: Preferred; Manufacturer Part Number: CC0603_2.2UF_16V_10%_X5R; Case: 0603; Mounted: Yes; Socket: No; SMD: Yes; Sense: No; Manufacturer1 Example: YAGEO; Manufacturer1 ComponentHeight: 0.9mm; HelpURL: \\cern.ch\dfs\Applications\Altium\Datasheets\CC0805_X5R_PHYCOMP_HC.pdf; Author: CERN DEM JLC; CreateDate: 28.04.2011; LatestRevisionDate: 28.04.2011
C82 = CC0603_1UF_25V_10%_X7R: Non-polarised capacitor; Part Description: SMD Multilayer Chip Ceramic Capacitor; Manufacturer: GENERIC; Manufacturer1 Part Number: GRM188R71E105KA12D; Voltage: 25V; TC: X7R; Tolerance: ±10%; Part Number: CC0603_1UF_25V_10%_X7R; Component Kind: Standard; Component Type: Standard; Pin Count: 2; Value: 1uF; Status: None; Manufacturer Part Number: CC0603_1UF_25V_10%_X7R; Case: 0603; Mounted: Yes; Socket: No; SMD: Yes; Sense: No; Manufacturer1 Example: MURATA; Manufacturer1 ComponentHeight: 0.9mm; HelpURL: \\cern.ch\dfs\Applications\Altium\Datasheets\CC0603_X7R_MURATA.pdf; Author: CERN DEM JLC; CreateDate: 18.01.2011; LatestRevisionDate: 18.01.2011
IC3 = MAX6250ACSA+: 1ppm/°C, Low-Noise, Precision, +5.000V Voltage Reference; Manufacturer: MAXIM; PressFit: No; Bonding: No; Part Number: MAX6250ACSA+; Component Kind: Standard; Component Type: Standard; Device: MAX6250ACSA+; PackageDescription: SOIC 8, Pitch 1.27mm, Body 4x5mm, IPC Medium Density; Part Description: 1ppm/°C, Low-Noise, Precision, +5.000V Voltage Reference; Manufacturer Part Number: MAX6250ACSA+; Pin Count: 5; Case: SOIC8; Mounted: Yes; Socket: No; SMD: Yes; Sense: No; ComponentHeight: 1.75mm; HelpURL: \\cern.ch\dfs\Applications\Altium\Datasheets\MAX6250ACSA+.pdf; Author: CERN DEM JMW; CreateDate: 06.07.2015; LatestRevisionDate: 06.07.2015
IC18 = DAC_AD5372: 32-Channel, 16-Bit, Serial Input, Voltage Output Digital-to-Analog Converter; Manufacturer: ANALOG DEVICES; PressFit: No; Bonding: No; Part Number: AD5372BCPZ; Component Kind: Standard; Component Type: Standard; Device: AD5372BCPZ; PackageDescription: QFN, 0.50mm Pitch, Square; 64 Pin, 9.00mm L X 9.00mm W X 1.00mm H Body (7.25 X 7.25mm Thermal Tab), IPC Medium Density; Part Description: 32-Channel, 16-Bit, Serial Input, Voltage Output Digital-to-Analog Converter; Manufacturer Part Number: AD5372BCPZ; Pin Count: 65; Case: QFN64; Mounted: Yes; Socket: No; SMD: Yes; Sense: No; ComponentHeight: 1mm; Author: GK; HelpURL: \\cern.ch\dfs\Applications\Altium\Datasheets\AD5373BCPZ.pdf; CreateDate: 14.03.2017; LatestRevisionDate: 14.03.2017
L1 = IND_10UH_10%_MURATA-PS_8400: Inductor With Core; Part Description: Miniature Surface Mount Power Inductor (8400 Serie); Manufacturer: MURATA POWER SOLUTIONS; Manufacturer Part Number: 84103C; Power: 950mA; Resistance: 0.24R; Tolerance: ±10%; Part Number: IND_10UH_10%_MURATA-PS_8400; Component Kind: Standard; Component Type: Standard; Pin Count: 2; Value: 10uH; Status: None; Mounted: Yes; Socket: No; SMD: Yes; Sense: No; ComponentHeight: 2.9mm; HelpURL: \\cern.ch\dfs\Applications\Altium\Datasheets\IND_MURATA-PS_8400.pdf; Author: CERN DEM JLC; CreateDate: 02.07.2012; LatestRevisionDate: 02.07.2012
R3 = R0402_0R_JUMPER: Resistor; Part Description: 1A (0.05R Max DC Resistance) Zero Ohm Jumper; Manufacturer: GENERIC; Manufacturer1 Part Number: 232270591001L; Part Number: R0402_0R_JUMPER; Component Kind: Standard; Component Type: Standard; Pin Count: 2; Value: 0; Status: Not recommended; Manufacturer Part Number: R0402_0R_JUMPER; Case: 0402; Mounted: Yes; Sense: No; Socket: No; SMD: Yes; Manufacturer1 Example: YAGEO PHYCOMP; Manufacturer1 ComponentHeight: 0.4mm; HelpURL: \\cern.ch\dfs\Applications\Altium\Datasheets\R0402_Phycomp_RC0402.pdf; Author: CERN DEM JLC; CreateDate: 03.12.2007; LatestRevisionDate: 17.10.2012
R58 R82 = R0603_220R_1%_0.1W_100PPM: Resistor - 1%; Part Description: General Purpose Thick Film Chip Resistor; Manufacturer: GENERIC; Manufacturer1 Part Number: NRC06F2200TRF; Power: 0.1W; TC: ±100ppm/°C; Part Number: R0603_220R_1%_0.1W_100PPM; Component Kind: Standard; Component Type: Standard; Pin Count: 2; Value: 220; Status: Preferred; Tolerance: ±1%; Manufacturer Part Number: R0603_220R_1%_0.1W_100PPM; Case: 0603; Mounted: Yes; Sense: No; Socket: No; SMD: Yes; Manufacturer1 Example: NIC COMPONENT; Manufacturer1 ComponentHeight: 0.55mm; HelpURL: \\cern.ch\dfs\Applications\Altium\Datasheets\R0603_NIC_NRC.pdf; Author: CERN DEM JLC; CreateDate: 03.12.2007; LatestRevisionDate: 13.03.2008
TP1-TP5 TP15-TP17 = SMD_PAD_1.27X1.27MM: Part Description: 1.27mm x 1.27mm PCB Copper Area (SMD Test Point); Mounted: No; Part Number: SMD_PAD_1.27X1.27MM; Component Kind: Standard (No BOM); Component Type: Standard (No BOM); Pin Count: 1; Family: Test Point; Socket: No; SMD: Yes; Sense: No; Status: None; ComponentHeight: 0mm; HelpURL: Undefined; Author: CERN DEM JLC; CreateDate: 12.01.2008; LatestRevisionDate: 12.01.2008; PackageDescription: 1.27mm x 1.27mm PCB Copper Area (SMD Test Point)

## Sheet LVDS_IFC_DAC.SchDoc: LVDS & I2C
size 420 x 297 mm; Author: G.K.; CompanyName: WUT; DrawnBy: G.K.; Organization: WUT ISE; Address1: Warsaw Univeristy of Technology; Address2: Nowowiejska 15/19; DocumentNumber: 7; Revision: -; SheetNumber: 7; SheetTotal: 7; EDA_Number: ARTIQ; Projet: Zotino; ModifiedBy: -; CreateDate: XX/XX/XXXX; CheckedDate: -; Title2: interfaces; DivGrp: ISE; Designer: G.K.; ModifiedDate: -; ProjectName: 32 CHANNEL 16bit DAC
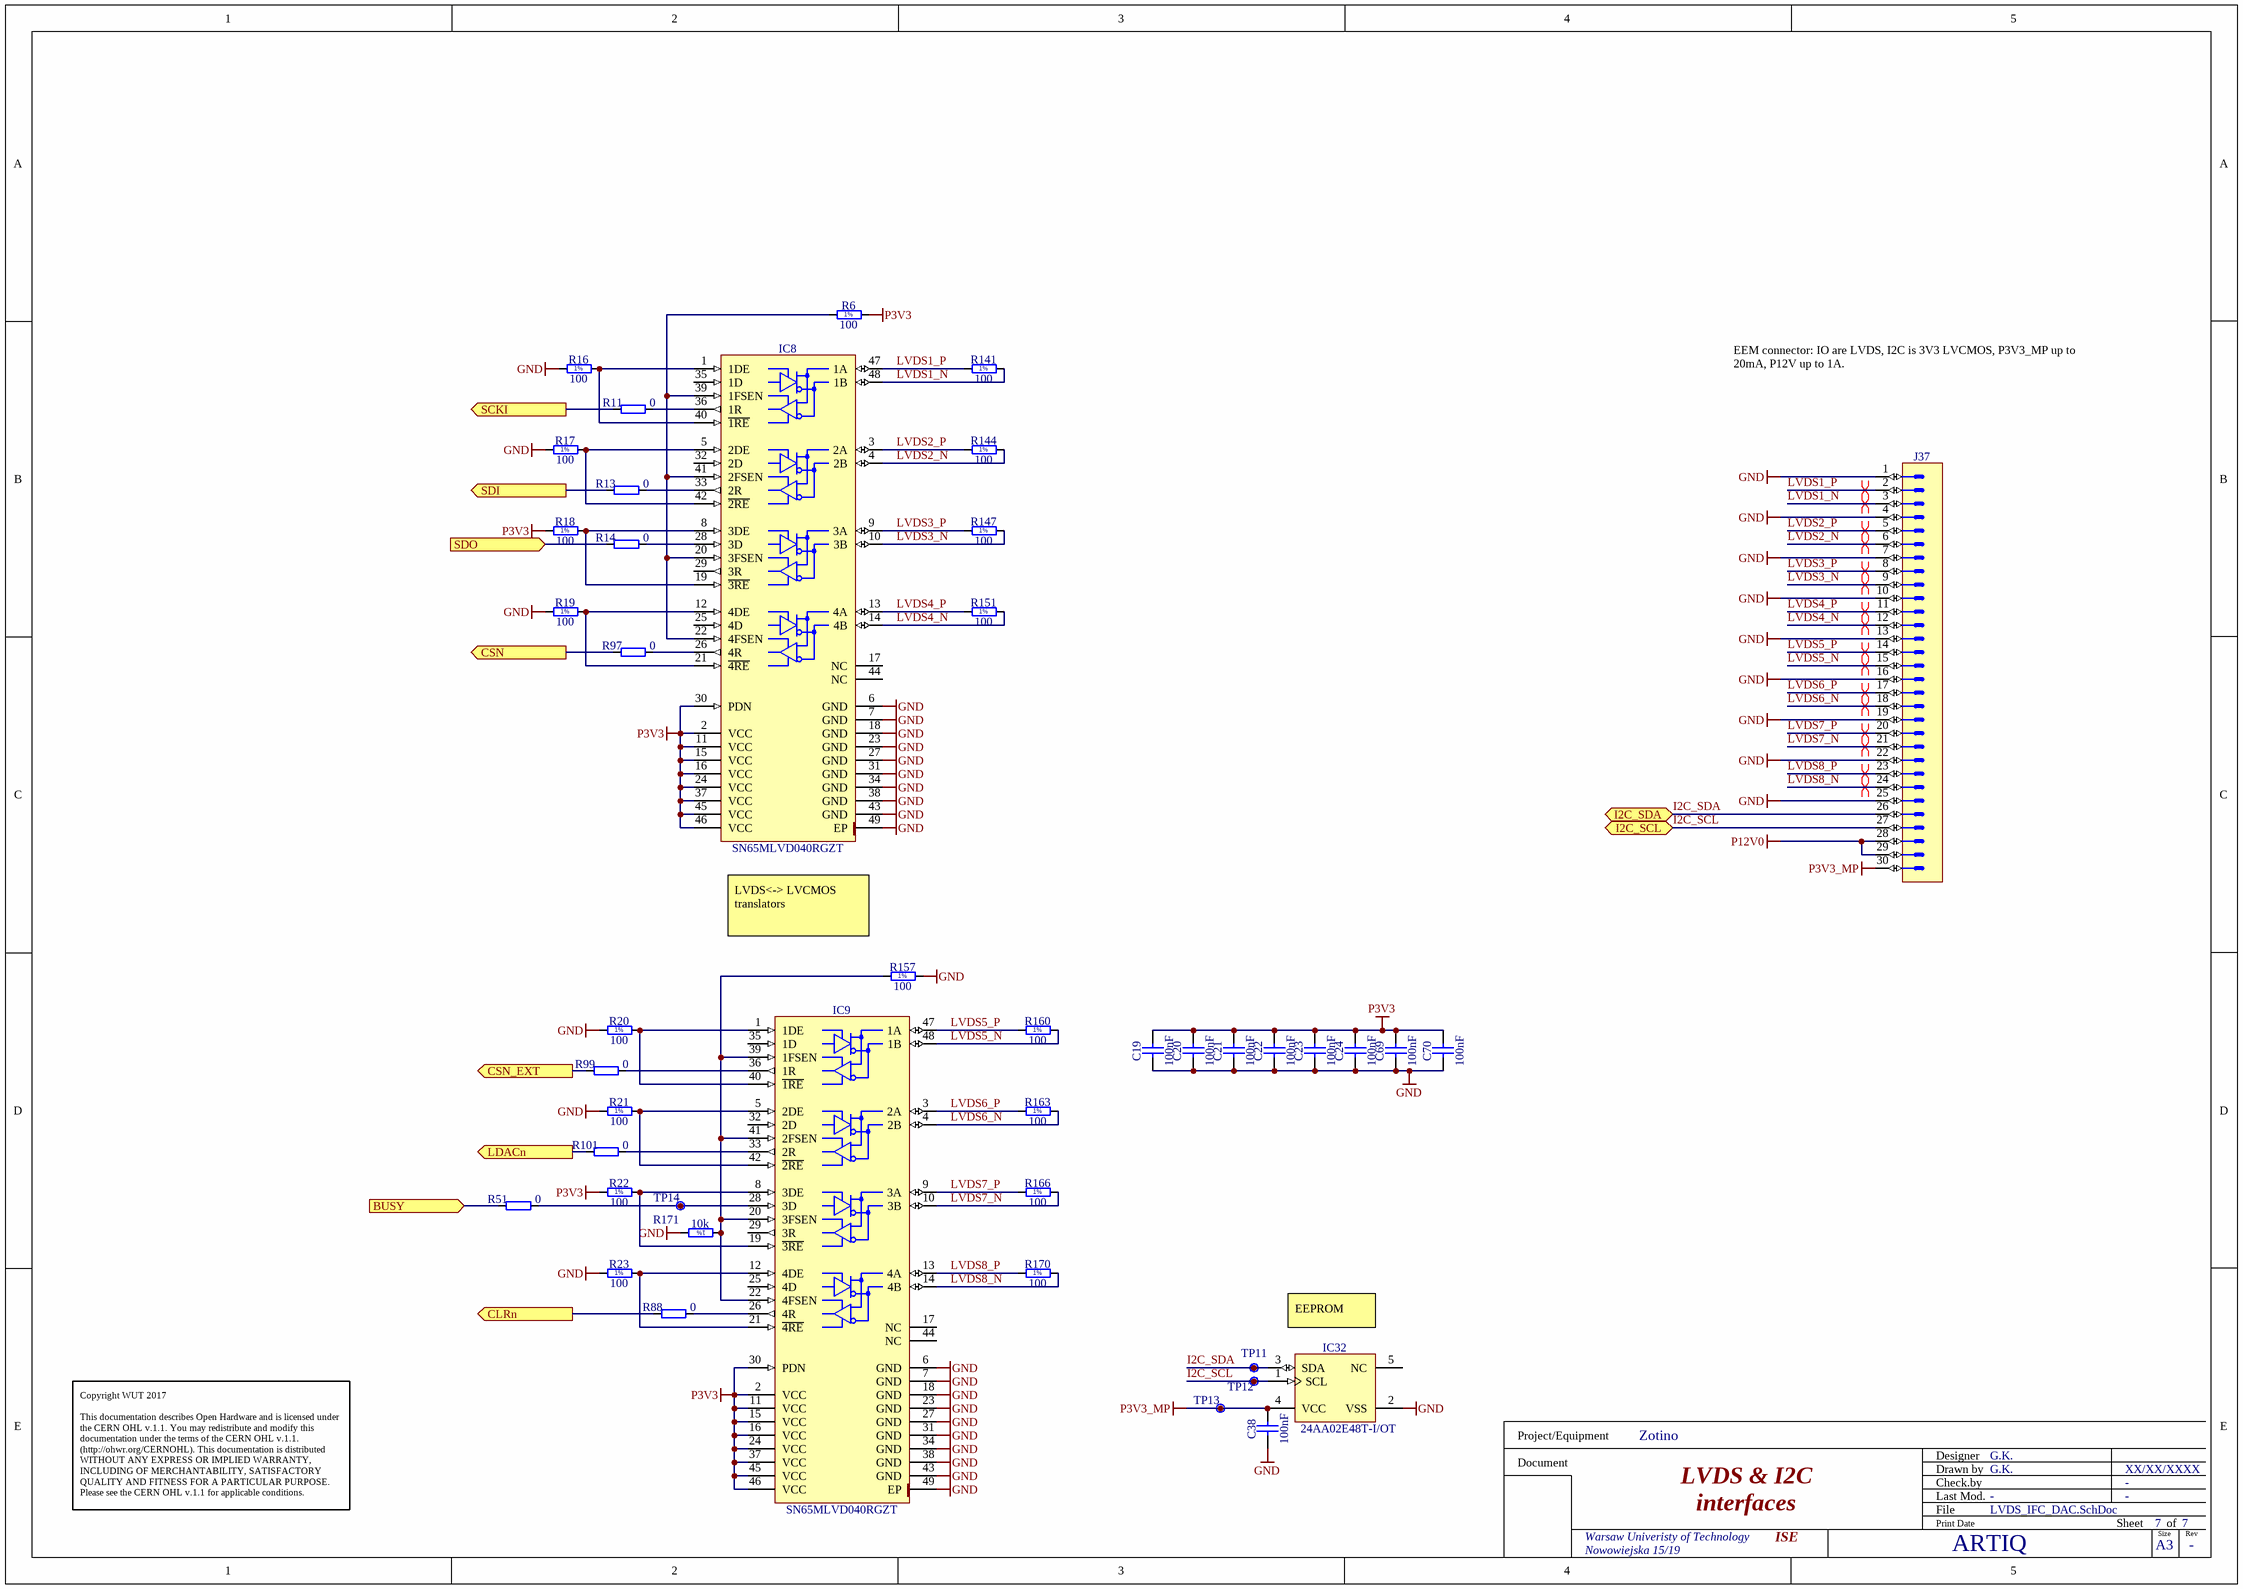
[diagram p5: LVDS_IFC_DAC.SchDoc]

### Parts
C19  100nF  [CAPC1005X55N]
C20  100nF  [CAPC1005X55N]
C21  100nF  [CAPC1005X55N]
C22  100nF  [CAPC1005X55N]
C23  100nF  [CAPC1005X55N]
C24  100nF  [CAPC1005X55N]
C38  100nF  [CAPC1005X55N]
C69  100nF  [CAPC1005X55N]
C70  100nF  [CAPC1005X55N]
IC8  SN65MLVD040RGZT  [QFN50P700X700X100-49N-S420]
IC9  SN65MLVD040RGZT  [QFN50P700X700X100-49N-S420]
IC32  24AA02E48T-I/OT  [SOT95P280X145-5N]
J37  (no value)  [3M_N2530-6002RB]
R6  100  [RESC1005X40N]
R11  0  [RESC1005X40N]
R13  0  [RESC1005X40N]
R14  0  [RESC1005X40N]
R16  100  [RESC1005X40N]
R17  100  [RESC1005X40N]
R18  100  [RESC1005X40N]
R19  100  [RESC1005X40N]
R20  100  [RESC1005X40N]
R21  100  [RESC1005X40N]
R22  100  [RESC1005X40N]
R23  100  [RESC1005X40N]
R51  0  [RESC1005X40N]
R88  0  [RESC1005X40N]
R97  0  [RESC1005X40N]
R99  0  [RESC1005X40N]
R101  0  [RESC1005X40N]
R141  100  [RESC1005X40N]
R144  100  [RESC1005X40N]
R147  100  [RESC1005X40N]
R151  100  [RESC1005X40N]
R157  100  [RESC1005X40N]
R160  100  [RESC1005X40N]
R163  100  [RESC1005X40N]
R166  100  [RESC1005X40N]
R170  100  [RESC1005X40N]
R171  10k  [RESC1005X40N]
TP11  Test Point  [TPS127]  (value not drawn)
TP12  Test Point  [TPS127]  (value not drawn)
TP13  Test Point  [TPS127]  (value not drawn)
TP14  Test Point  [TPS127]  (value not drawn)

### Ports
BUSY (in), CLRn (out), CSN (out), CSN_EXT (out), I2C_SCL (bidir), I2C_SDA (bidir), LDACn (out), SCKI (out), SDI (out), SDO (in)

### Nets
GND: C19.1 C20.1 C21.1 C22.1 C23.1 C24.1 C38.1 C69.1 C70.1 IC8.6(GND) IC8.7(GND) IC8.18(GND) IC8.23(GND) IC8.27(GND) IC8.31(GND) IC8.34(GND) IC8.38(GND) IC8.43(GND) IC8.49(EP) IC9.6(GND) IC9.7(GND) IC9.18(GND) IC9.23(GND) IC9.27(GND) IC9.31(GND) IC9.34(GND) IC9.38(GND) IC9.43(GND) IC9.49(EP) IC32.2(VSS) J37.1 J37.4 J37.7 J37.10 J37.13 J37.16 J37.19 J37.22 J37.25 R16.1 R17.1 R19.1 R20.1 R21.1 R23.1 R157.2 R171.2
P3V3: C19.2 C20.2 C21.2 C22.2 C23.2 C24.2 C69.2 C70.2 IC8.2(VCC) IC8.11(VCC) IC8.15(VCC) IC8.16(VCC) IC8.24(VCC) IC8.30(PDN) IC8.37(VCC) IC8.45(VCC) IC8.46(VCC) IC9.2(VCC) IC9.11(VCC) IC9.15(VCC) IC9.16(VCC) IC9.24(VCC) IC9.30(PDN) IC9.37(VCC) IC9.45(VCC) IC9.46(VCC) R6.2 R18.1 R22.1
P3V3_MP: C38.2 IC32.4(VCC) J37.30 TP13.1
P12V0: J37.28 J37.29
CSN_EXT: R99.1 ; port CSN_EXT
I2C_SCL: IC32.1(SCL) J37.27 TP12.1 ; port I2C_SCL
I2C_SDA: IC32.3(SDA) J37.26 TP11.1 ; port I2C_SDA
LVDS1_N: IC8.48(1B) J37.3 R141.2
LVDS1_P: IC8.47(1A) J37.2 R141.1
LVDS2_N: IC8.4(2B) J37.6 R144.2
LVDS2_P: IC8.3(2A) J37.5 R144.1
LVDS3_N: IC8.10(3B) J37.9 R147.2
LVDS3_P: IC8.9(3A) J37.8 R147.1
LVDS4_N: IC8.14(4B) J37.12 R151.2
LVDS4_P: IC8.13(4A) J37.11 R151.1
LVDS5_N: IC9.48(1B) J37.15 R160.2
LVDS5_P: IC9.47(1A) J37.14 R160.1
LVDS6_N: IC9.4(2B) J37.18 R163.2
LVDS6_P: IC9.3(2A) J37.17 R163.1
LVDS7_N: IC9.10(3B) J37.21 R166.2
LVDS7_P: IC9.9(3A) J37.20 R166.1
LVDS8_N: IC9.14(4B) J37.24 R170.2
LVDS8_P: IC9.13(4A) J37.23 R170.1
SCKI: R11.1 ; port SCKI
SDI: R13.1 ; port SDI
NetIC8_1: IC8.1(1DE) IC8.40(~{1RE}) R16.2
NetIC8_5: IC8.5(2DE) IC8.42(~{2RE}) R17.2
NetIC8_8: IC8.8(3DE) IC8.19(~{3RE}) R18.2
NetIC8_12: IC8.12(4DE) IC8.21(~{4RE}) R19.2
NetIC8_20: IC8.20(3FSEN) IC8.22(4FSEN) IC8.39(1FSEN) IC8.41(2FSEN) R6.1
NetIC8_26: IC8.26(4R) R97.2
NetIC8_28: IC8.28(3D) R14.2
NetIC8_33: IC8.33(2R) R13.2
NetIC8_36: IC8.36(1R) R11.2
NetIC9_1: IC9.1(1DE) IC9.40(~{1RE}) R20.2
NetIC9_5: IC9.5(2DE) IC9.42(~{2RE}) R21.2
NetIC9_8: IC9.8(3DE) IC9.19(~{3RE}) R22.2
NetIC9_12: IC9.12(4DE) IC9.21(~{4RE}) R23.2
NetIC9_20: IC9.20(3FSEN) IC9.22(4FSEN) IC9.39(1FSEN) IC9.41(2FSEN) R157.1 R171.1
NetIC9_26: IC9.26(4R) R88.2
NetIC9_28: IC9.28(3D) R51.2 TP14.1
NetIC9_33: IC9.33(2R) R101.2
NetIC9_36: IC9.36(1R) R99.2
NetIC18_2: R51.1 ; port BUSY
NetIC18_53: R97.1 ; port CSN
NetIC18_56: R14.1 ; port SDO
NetIC18_63: R101.1 ; port LDACn
NetIC18_64: R88.1 ; port CLRn

Not connected (* = marked no-connect by the designer): IC8 17(NC) 25(4D) 29(3R) 32(2D) 35(1D) 44(NC); IC9 17(NC) 25(4D) 29(3R) 32(2D) 35(1D) 44(NC); IC32 5(NC)

### Layout directives
differential pair: LVDS1_N, LVDS1_P, LVDS2_N, LVDS2_P, LVDS3_N, LVDS3_P, LVDS4_N, LVDS4_P, LVDS5_N, LVDS5_P, LVDS6_N, LVDS6_P, LVDS7_N, LVDS7_P, LVDS8_N, LVDS8_P

### Notes on the sheet
- EEM connector: IO are LVDS, I2C is 3V3 LVCMOS, P3V3_MP up to 20mA, P12V up to 1A.
- LVDS<-> LVCMOS translators
- EEPROM
- Copyright WUT 2017
  This documentation describes Open Hardware and is licensed under the CERN OHL v.1.1. You may redistribute and modify this documentation under the terms of the CERN OHL v.1.1. (http://ohwr.org/CERNOHL). This documentation is distributed WITHOUT ANY EXPRESS OR IMPLIED WARRANTY, INCLUDING OF MERCHANTABILITY, SATISFACTORY QUALITY AND FITNESS FOR A PARTICULAR PURPOSE. Please see the CERN OHL v.1.1 for applicable conditions.
- Project/Equipment
- Document
- Designer
- Drawn by
- Check.by
- File
- Last Mod.
- Print Date
- Sheet
- Size
- A3
- of
- Rev
- (in symbol R0402_10K_1%_0.0625W_100PPM) 1%
- (in symbol R0402_100R_1%_0.1W_100PPM) 1%

### Library data of the parts
C19-C24 C38 C69 C70 = CC0402_100NF_16V_10%_X5R: Non-polarised capacitor; Part Description: SMD Multilayer Chip Ceramic Capacitor; Manufacturer: GENERIC; Manufacturer1 Part Number: GRM155R61C104KA88D; Voltage: 16V; TC: X5R; Tolerance: ±10%; Part Number: CC0402_100NF_16V_10%_X5R; Component Kind: Standard; Component Type: Standard; Pin Count: 2; Value: 100nF; Status: None; Manufacturer Part Number: CC0402_100NF_16V_10%_X5R; Case: 0402; Mounted: Yes; Socket: No; SMD: Yes; Sense: No; Manufacturer1 Example: MURATA; Manufacturer1 ComponentHeight: 0.55mm; HelpURL: \\cern.ch\dfs\Applications\Altium\Datasheets\CC0402_X5R_MURATA_GRM.pdf; Author: CERN DEM JLC; CreateDate: 10.12.2013; LatestRevisionDate: 10.12.2013
IC8 IC9 = SN65MLVD040RGZT: 4-Channel Half-Duplex M-LVDS Line Transceiver; Manufacturer: TEXAS INSTRUMENTS; PressFit: No; Bonding: No; Part Number: SN65MLVD040RGZT; Component Kind: Standard; Component Type: Standard; Device: SN65MLVD040RGZT; PackageDescription: QFN, 0.50mm Pitch, Square; 48 Pin, 7.00mm L X 7.00mm W X 1mm H body (W/Thermal Tab 4.2mm X 4.2mm), IPC Medium Density; Part Description: 4-Channel Half-Duplex M-LVDS Line Transceiver; Manufacturer Part Number: SN65MLVD040RGZT; Pin Count: 49; Case: QFN48; Mounted: Yes; Socket: No; SMD: Yes; Sense: No; ComponentHeight: 1mm; Author: CERN DEM JLC; HelpURL: \\cern.ch\dfs\Applications\Altium\Datasheets\SN65MLVD040RGZT.pdf; CreateDate: 17.03.2011; LatestRevisionDate: 17.03.2011
IC32 = 24AA02E48T-I/OT: 1.7V-5.5V, 2K I2C Serial EEPROM With EUI-48 Node Identity; Manufacturer: MICROCHIP TECHNOLOGY; PressFit: No; Bonding: No; Part Number: 24AA02E48T-I/OT; Component Kind: Standard; Component Type: Standard; Device: 24AA02E48T-I/OT; PackageDescription: SOT, 0.95mm pitch; 5 pin, 1.60mm W X 2.90mm L X 1.45mm H body, IPC Medium Density; Part Description: 1.7V-5.5V, 2K I2C Serial EEPROM With EUI-48 Node Identity; Manufacturer Part Number: 24AA02E48T-I/OT; Pin Count: 5; Case: SOT23-5; Mounted: Yes; Socket: No; SMD: Yes; Sense: No; ComponentHeight: 1.45mm; HelpURL: \\cern.ch\dfs\Applications\Altium\Datasheets\24AA02E48T-I-OT.pdf; Author: CERN DEM MR; CreateDate: 31.03.2016; LatestRevisionDate: 31.03.2016
J37 = 3M_N2530-6002RB: Connector 30 Male; Part Description: 30 Contacts - Straight .100'' x .100'' Low Profile Four-Wall Header, 2500 Series; Manufacturer: 3M; PressFit: No; Part Number: 3M_N2530-6002RB; Component Kind: Standard; Component Type: Standard; Pin Count: 30; Family: Header 30; Mounted: Yes; Socket: No; SMD: No; Sense: No; Status: None; Manufacturer Part Number: N2530-6002RB; ComponentHeight: 10.03mm; HelpURL: \\cern.ch\dfs\Applications\Altium\Datasheets\3M_N2530-6002RB.pdf; Author: CERN DEM JLC; CreateDate: 11.02.2009; LatestRevisionDate: 11.08.2009
R6 R16-R23 R141 R144 R147 R151 R157 R160 R163 R166 R170 = R0402_100R_1%_0.1W_100PPM: Resistor - 1%; Part Description: General Purpose Thick Film Chip Resistor; Manufacturer: GENERIC; Manufacturer Part Number: R0402_100R_1%_0.1W_100PPM_50V; Manufacturer1 Part Number: ERJ2RKF1000X; Power: 0.1W; TC: ±100ppm/°C; Voltage: 50V; Part Number: R0402_100R_1%_0.1W_100PPM; Component Kind: Standard; Component Type: Standard; Pin Count: 2; Value: 100; Status: Not recommended; Tolerance: ±1%; Case: 0402; Mounted: Yes; Sense: No; Socket: No; SMD: Yes; Manufacturer1 Example: PANASONIC; Manufacturer1 ComponentHeight: 0.4mm; HelpURL: \\cern.ch\dfs\Applications\Altium\Datasheets\R0402_PANASONIC_ERJ2RK.pdf; Author: CERN DEM JLC; CreateDate: 12.12.2013; LatestRevisionDate: 03.03.2015
R11 R13 R14 R51 R88 R97 R99 R101 = R0402_0R_JUMPER: as R3 on sheet DAC_32CH; Part Number: R0402_0R_JUMPER; Component Kind: Standard; Component Type: Standard; Pin Count: 2; Value: 0; Status: Not recommended; Manufacturer Part Number: R0402_0R_JUMPER; Case: 0402; Mounted: Yes; Sense: No; Socket: No; SMD: Yes; Manufacturer1 Example: YAGEO PHYCOMP; Manufacturer1 ComponentHeight: 0.4mm; HelpURL: \\cern.ch\dfs\Applications\Altium\Datasheets\R0402_Phycomp_RC0402.pdf; Author: CERN DEM JLC; CreateDate: 03.12.2007; LatestRevisionDate: 17.10.2012
R171 = R0402_10K_1%_0.0625W_100PPM: Resistor - 1%; Part Description: General Purpose Thick Film Chip Resistor; Manufacturer: GENERIC; Manufacturer1 Part Number: 232270671003L; TC: ±100ppm/°C; Part Number: R0402_10K_1%_0.0625W_100PPM; Component Kind: Standard; Component Type: Standard; Pin Count: 2; Value: 10k; Status: Not recommended; Power: 0.0625W; Tolerance: ±1%; Manufacturer Part Number: R0402_10K_1%_0.0625W_100PPM; Case: 0402; Mounted: Yes; Sense: No; Socket: No; SMD: Yes; Manufacturer1 Example: YAGEO PHYCOMP; Manufacturer1 ComponentHeight: 0.4mm; HelpURL: \\cern.ch\dfs\Applications\Altium\Datasheets\R0402_Phycomp_RC0402.pdf; Author: CERN DEM JLC; CreateDate: 03.12.2007; LatestRevisionDate: 17.10.2012
TP11-TP14 = SMD_PAD_1.27X1.27MM: as TP1 on sheet DAC_32CH; Part Number: SMD_PAD_1.27X1.27MM; Component Kind: Standard (No BOM); Component Type: Standard (No BOM); Pin Count: 1; Family: Test Point; Socket: No; SMD: Yes; Sense: No; Status: None; ComponentHeight: 0mm; HelpURL: Undefined; Author: CERN DEM JLC; CreateDate: 12.01.2008; LatestRevisionDate: 12.01.2008; PackageDescription: 1.27mm x 1.27mm PCB Copper Area (SMD Test Point)